# Altium schematic sheet Prj_CamBienLua.SchDoc
size A4; SheetNumber: 1; SheetTotal: 1
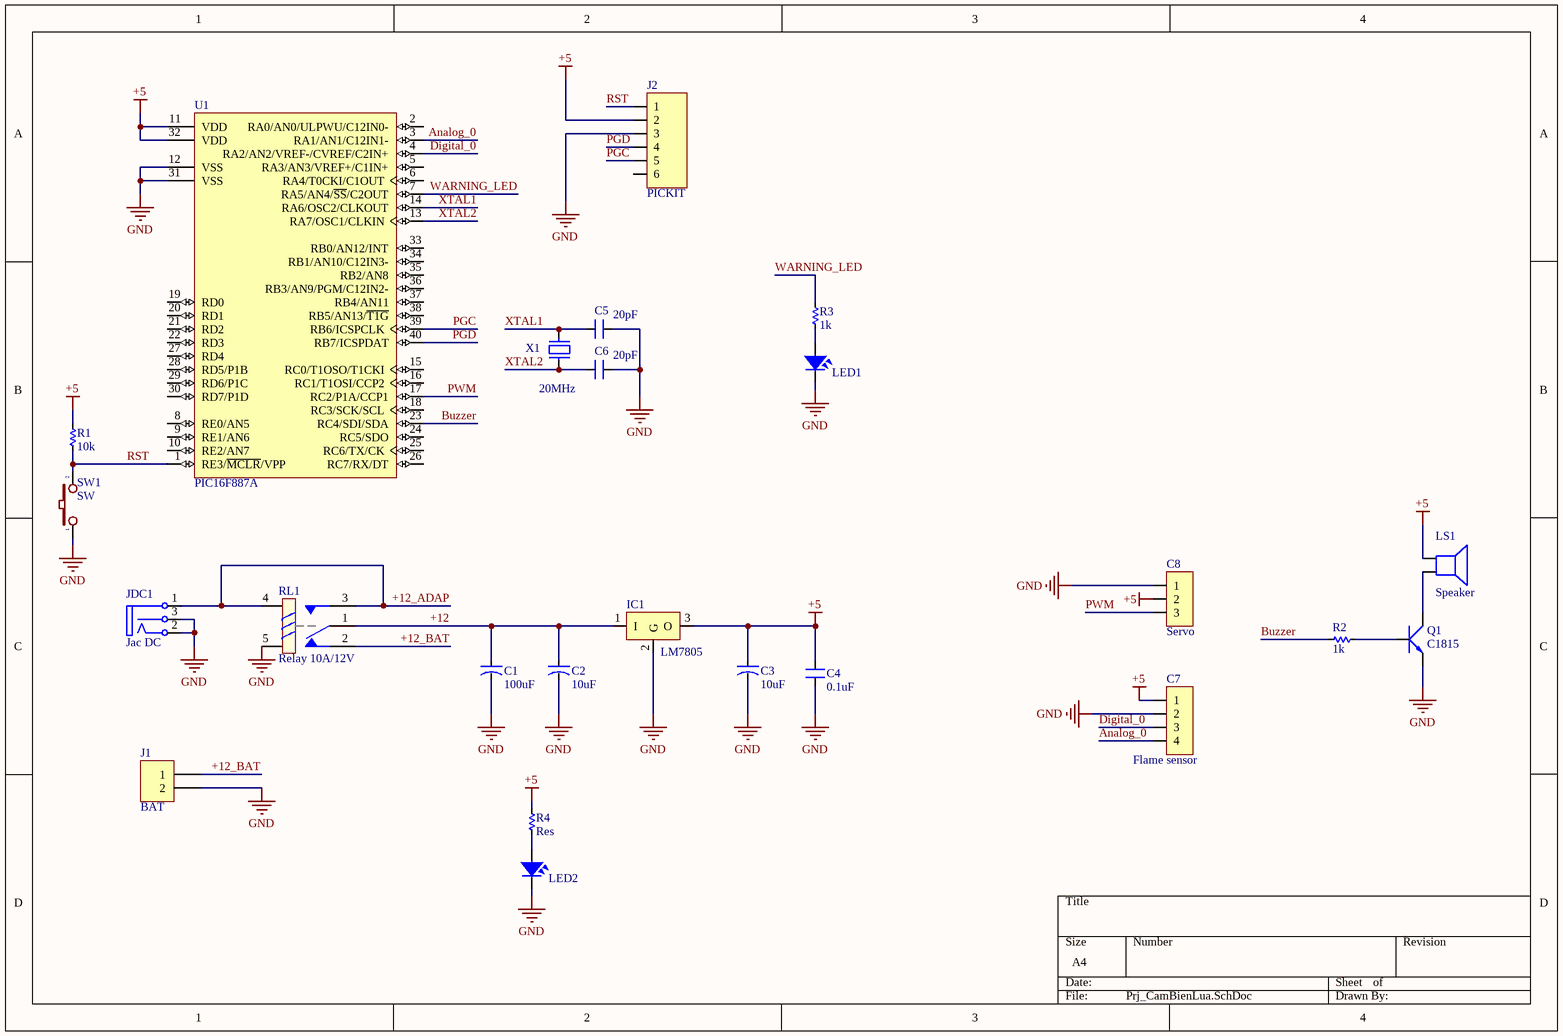
[diagram p0: Prj_CamBienLua.SchDoc]

## Parts
C1  100uF  [CA-ALU-5]
C2  10uF  [CA-ALU-5]
C3  10uF  [CA-ALU-5]
C4  0.1uF  [CN1.5]
C5  20pF  [CN1.5]
C6  20pF  [CN1.5]
C7  Flame sensor  [JP4-C1T]
C8  Servo  [JP3-D1T]
IC1  LM7805  [TO220-123]
J1  BAT  [KF2-5.08]
J2  PICKIT  [JP6-C1T]
JDC1  Jac DC  [DC0]
LED1  LED  [LED-3MM-RED]  (value not drawn)
LED2  LED  [LED-3MM-RED]  (value not drawn)
LS1  Speaker  [SPEAKER]
Q1  C1815  [TO92-123]
R1  10k  [RES-1/4W]
R2  1k  [RES-1/4W]
R3  1k  [RES-1/4W]
R4  Res  [RES-1/4W]
RL1  Relay 10A/12V  [Relay - SRD-03VDC-SL-C]
SW1  SW  [SW2-DIP]
U1  PIC16F887A  [DIP40/W0.6]
X1  20MHz  [XT2]

## Nets
+5: C3.1 C4.2 C7.1 C8.2 IC1.3(O) J2.2 LS1.1 R1.2 R4.1 U1.11(VDD) U1.32(VDD)
GND: C1.2 C2.2 C3.2 C4.1 C5.2 C6.2 C7.2 C8.1 IC1.2(G) J1.2 J2.3 JDC1.2(TN) JDC1.3(S) LED1.2 LED2.2 Q1.1(E) RL1.5 SW1.1 U1.12(VSS) U1.31(VSS)
+12: C1.1 C2.1 IC1.1(I) RL1.1
+12_ADAP: JDC1.1(T) RL1.3 RL1.4
+12_BAT: J1.1 RL1.2
Analog_0: C7.4 U1.3(RA1/AN1/C12IN1-)
Buzzer: R2.1 U1.23(RC4/SDI/SDA)
Digital_0: C7.3 U1.4(RA2/AN2/VREF-/CVREF/C2IN+)
PGC: J2.5 U1.39(RB6/ICSPCLK)
PGD: J2.4 U1.40(RB7/ICSPDAT)
PWM: C8.3 U1.17(RC2/P1A/CCP1)
RST: J2.1 R1.1 SW1.2 U1.1(RE3/~{MCLR}/VPP)
WARNING_LED: R3.1 U1.7(RA5/AN4/~{SS}/C2OUT)
XTAL1: C5.1 U1.14(RA6/OSC2/CLKOUT) X1.2
XTAL2: C6.1 U1.13(RA7/OSC1/CLKIN) X1.1
NetLED1_1: LED1.1 R3.2
NetLED2_1: LED2.1 R4.2
NetLS1_2: LS1.2 Q1.2(C)
NetQ1_3: Q1.3(B) R2.2

Not connected (* = marked no-connect by the designer): J2 6; U1 2(RA0/AN0/ULPWU/C12IN0-) 5(RA3/AN3/VREF+/C1IN+) 6(RA4/T0CKI/C1OUT) 8(RE0/AN5) 9(RE1/AN6) 10(RE2/AN7) 15(RC0/T1OSO/T1CKI) 16(RC1/T1OSI/CCP2) 18(RC3/SCK/SCL) 19(RD0) 20(RD1) 21(RD2) 22(RD3) 24(RC5/SDO) 25(RC6/TX/CK) 26(RC7/RX/DT) 27(RD4) 28(RD5/P1B) 29(RD6/P1C) 30(RD7/P1D) 33(RB0/AN12/INT) 34(RB1/AN10/C12IN3-) 35(RB2/AN8) 36(RB3/AN9/PGM/C12IN2-) 37(RB4/AN11) 38(RB5/AN13/~{T1G})

## Library data of the parts
C1-C3 = CN-ALU-DIP: Capacitor (Semiconductor SIM Model); Value: 104; LatestRevisionDate: 17-Jul-2002; LatestRevisionNote: Re-released for DXP Platform.; PackageReference: C1206; Publisher: Altium Limited
C4-C6 = CN: Value: 33pF
C7 = JP4: WR-PHD 2.54 mm Angled Socket Header; Manufacturer: W¨¹rth Elektronik eiSos GmbH; partNo: 613004143121; ComponentLink1 Description: Manufacturer; ComponentLink2 Description: Datasheet; NoPins: 04; Created Date: 29 March 2013; ComponentLink1URL: http://www.we-online.com; ComponentLink2URL: http://katalog.we-online.de/em/datasheet/6130xx143121.pdf; Created by: Karrer Zheng
C8 = JP3: WR-PHD 2.54 mm Angled Socket Header; Manufacturer: W¨¹rth Elektronik eiSos GmbH; partNo: 613003143121; ComponentLink1 Description: Manufacturer; ComponentLink2 Description: Datasheet; NoPins: 03; Created Date: 29 March 2013; ComponentLink1URL: http://www.we-online.com; ComponentLink2URL: http://katalog.we-online.de/em/datasheet/6130xx143121.pdf; Created by: Karrer Zheng
IC1 = LM78xx: Positive Voltage Regulator; Note: Tab is connected to pin 3 (GND).; Published: 24-Aug-2001; LatestRevisionDate: 17-Jul-2002; LatestRevisionNote: Re-released for DXP Platform.; DatasheetVersion: Apr-1994; PackageVersion: Jul-1998; PackageReference: ISOWATT220AB; Publisher: Altium Limited; PackageDescription: TO, Thru-Hole, Vertical, Heatsink Mounted; 3 In-Line Leads; Pitch 2.54 mm; Pin sequence 1, 3, 2; ComponentLink1Description: Manufacturer Link; ComponentLink1URL: http://www.st.com/; ComponentLink2Description: Datasheet; ComponentLink2URL: http://www.st.com/stonline/products/literature/ds/2146/l78m05c.pdf
J1 = KF2: Manufacturer: Würth Elektronik eiSos GmbH; partNo: 691103110002; ComponentLink1 Description: Manufacturer; ComponentLink2 Description: Datasheet; NoPins: 2; Created Date: 29 October 2013; ComponentLink1URL: http://www.we-online.com; ComponentLink2URL: http://katalog.we-online.de/em/datasheet/6911031100xx.pdf; Created by: Karrer Zheng
J2 = JP6: WR-PHD 2.54 mm Angled Socket Header; Manufacturer: W¨¹rth Elektronik eiSos GmbH; partNo: 613006143121; ComponentLink1 Description: Manufacturer; ComponentLink2 Description: Datasheet; NoPins: 06; Created Date: 29 March 2013; ComponentLink1URL: http://www.we-online.com; ComponentLink2URL: http://katalog.we-online.de/em/datasheet/6130xx143121.pdf; Created by: Karrer Zheng
JDC1 = DCIN: Jac DC input; Value: Jac DC
LED1 LED2 = LED: LED Single colour Green and Red; Value: LED 3 ly Single Colour
LS1 = Speaker: Loudspeaker; Published: 24-Mar-1999; LatestRevisionDate: 17-Jul-2002; LatestRevisionNote: Re-released for DXP Platform.; PackageReference: PIN2; Publisher: Altium Limited
Q1 = C458: NPN 600mW, ECB; Value: C1815
R1-R4 = Res: Manufacturer: Generic Components; Class: Passive; SubClass: R; Published: 08/06/2000; Publisher: Altium Hobart Technology Centre
RL1 = Relay 5: Relay SPDT,10A - 12VDC 5 Pin; Value: Relay SPDT, 10A, 12V
SW1 = SW2: Switch button 2 pin; pin to pad: 1>1+4 2>2+3; Value: SW chip 2 pin
U1 = PIC16F887-PU: Flash-Based, 8-Bit CMOS Microcontroller with nanoWatt Technology, 8K (x14-Bit words) Program Memory, 624 Bytes Data Memory, 35 I/O pins, 40-Pin PDIP, Standard VDD Range, Extended Temperature; Published: 29-Jan-2009; LatestRevisionDate: 02-Dec-2009; LatestRevisionNote: Updated datasheet to version revF, Apr-2009.; DatasheetVersion: revF, Apr-2009; PackageVersion: revBB, Aug-2009; PackageReference: PDIP600-P40; Publisher: Altium Limited; PackageDescription: 40-Lead Plastic Dual In-Line (P) - 600 mil Body [PDIP]; Supplier 1: Digi-Key; Supplier Part Number 1: PIC16F887-E/P-ND; Supplier 2: Farnell; Supplier Part Number 2: 1703423; ComponentLink1Description: Datasheet; ComponentLink1URL: http://ww1.microchip.com/downloads/en/DeviceDoc/41291F.pdf; ComponentLink2Description: Packaging Specification; ComponentLink2URL: http://www.microchip.com/stellent/groups/techpub_sg/documents/packagingspec/en012702.pdf; ComponentLink3Description: Microchip.com Home; ComponentLink3URL: http://www.microchip.com/
X1 = XT2: Crystal, 32.768 KHz, -40 to 85 degC, 3.2 x 1.5 x 0.9 mm SMD; Value: 4Mhz